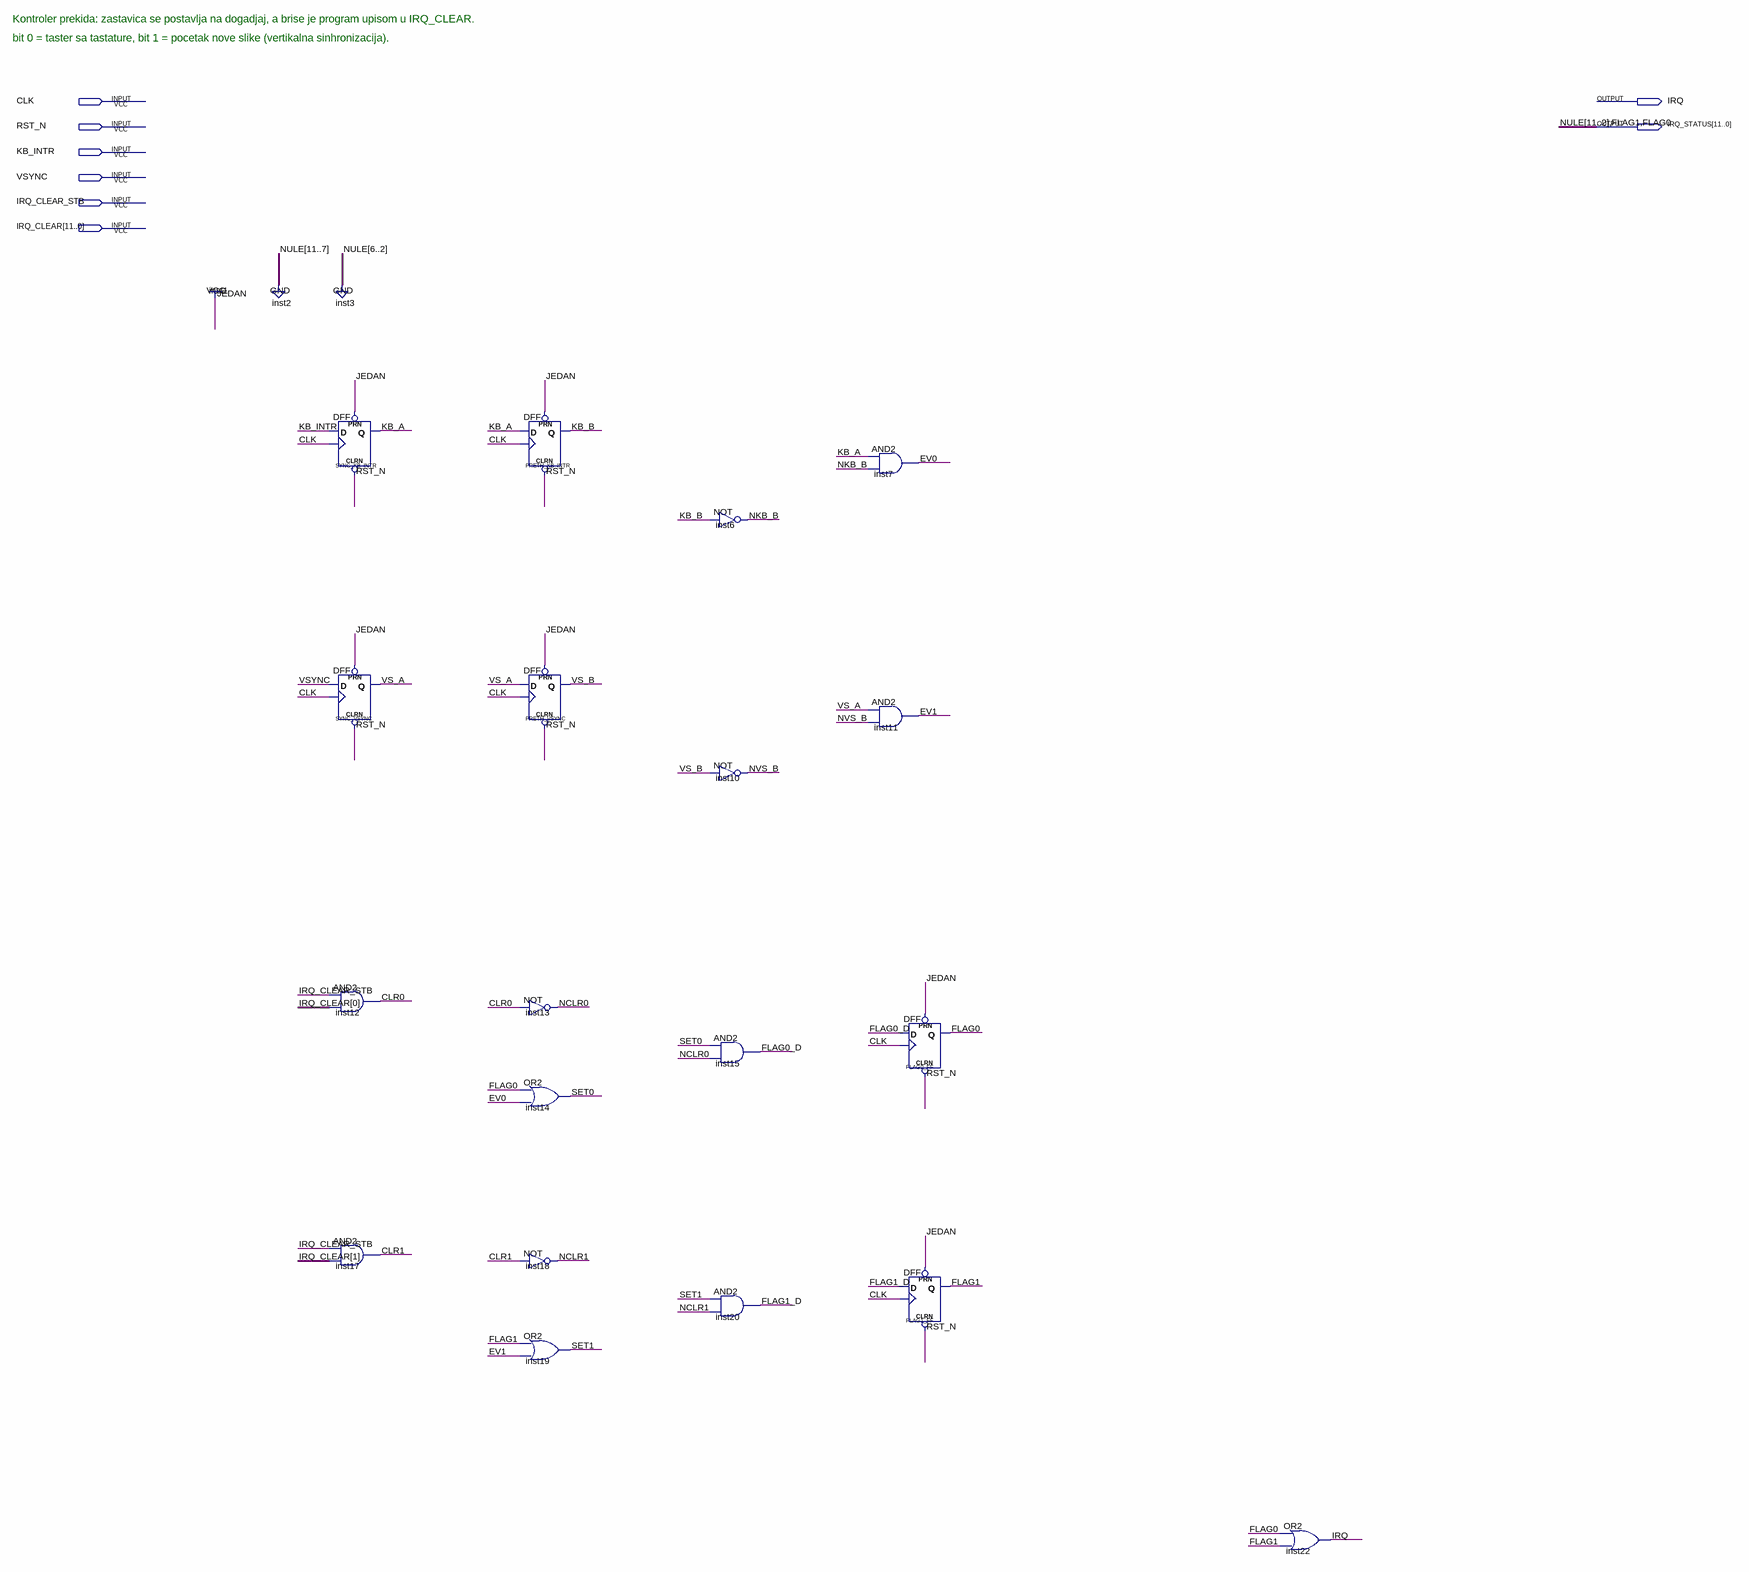
[diagram p0: schematic sheet]
// Quartus schematic irq_ctrl.bdf as structural Verilog: 19 symbols, 8 pins
module irq_ctrl (
  input  CLK,
  input  RST_N,
  input  KB_INTR,
  input  VSYNC,
  input  IRQ_CLEAR_STB,
  input  [11:0] IRQ_CLEAR,
  output IRQ,
  output [11:0] IRQ_STATUS
);

  wire CLR0, CLR1, EV0, EV1, FLAG0_D, FLAG1_D, KB_A, KB_B, NCLR0, NCLR1, NKB_B, NVS_B, SET0, SET1, VS_A, VS_B;

  DFF SYNC_KB_INTR (.CLRN(RST_N), .CLK(CLK), .D(KB_INTR), .PRN(1'b1), .Q(KB_A));
  DFF SYNC_VSYNC (.CLRN(RST_N), .CLK(CLK), .D(VSYNC), .PRN(1'b1), .Q(VS_A));
  and inst12 (CLR0, IRQ_CLEAR_STB, IRQ_CLEAR[0]);
  and inst17 (CLR1, IRQ_CLEAR_STB, IRQ_CLEAR[1]);
  DFF PRETH_KB_INTR (.CLRN(RST_N), .CLK(CLK), .D(KB_A), .PRN(1'b1), .Q(KB_B));
  DFF PRETH_VSYNC (.CLRN(RST_N), .CLK(CLK), .D(VS_A), .PRN(1'b1), .Q(VS_B));
  not inst13 (NCLR0, CLR0);
  or inst14 (SET0, IRQ_STATUS[0], EV0);
  not inst18 (NCLR1, CLR1);
  or inst19 (SET1, IRQ_STATUS[1], EV1);
  not inst6 (NKB_B, KB_B);
  not inst10 (NVS_B, VS_B);
  and inst15 (FLAG0_D, SET0, NCLR0);
  and inst20 (FLAG1_D, SET1, NCLR1);
  and inst7 (EV0, KB_A, NKB_B);
  and inst11 (EV1, VS_A, NVS_B);
  DFF FLAG0_FF (.CLRN(RST_N), .CLK(CLK), .D(FLAG0_D), .PRN(1'b1), .Q(IRQ_STATUS[0]));
  DFF FLAG1_FF (.CLRN(RST_N), .CLK(CLK), .D(FLAG1_D), .PRN(1'b1), .Q(IRQ_STATUS[1]));
  or inst22 (IRQ, IRQ_STATUS[0], IRQ_STATUS[1]);

  assign IRQ_STATUS[11:2] = {10{1'b0}};

  // Other names for the same wires on the sheet: FLAG0 = IRQ_STATUS[0]; FLAG1 = IRQ_STATUS[1]

  // Notes on the sheet:
  //   Kontroler prekida: zastavica se postavlja na dogadjaj, a brise je program upisom u IRQ_CLEAR.
  //   bit 0 = taster sa tastature, bit 1 = pocetak nove slike (vertikalna sinhronizacija).
endmodule
